# Altium schematic sheet subckt_Attenuator_HMC539ALP3.SchDoc: Attenuator HMC539ALP3
size A3; DocumentNumber: 11; Revision: 0; SheetNumber: 11; SheetTotal: 19
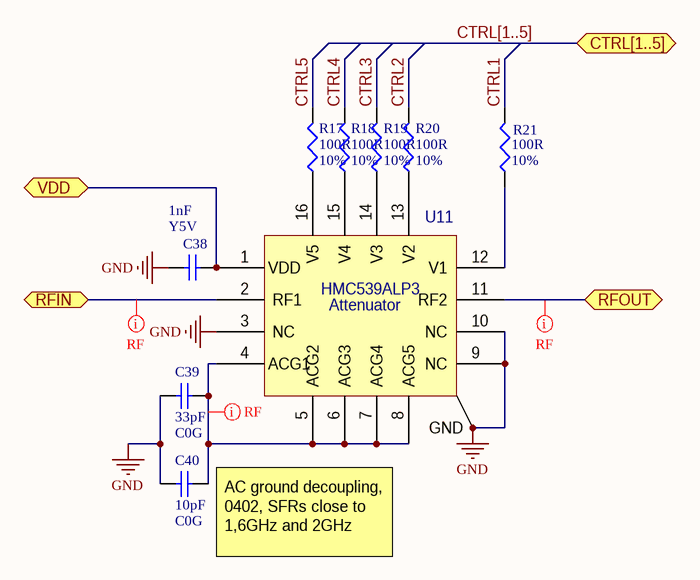
[diagram p0: subckt_Attenuator_HMC539ALP3.SchDoc]

## Parts
C38  value 1nF  Dielectric: Y5V  [CAP0603]  (hidden comment: Capacitor)
C39  value 33pF  Dielectric: C0G  [Model Name]  (hidden comment: Capacitor)
C40  value 10pF  Dielectric: C0G  [Model Name]  (hidden comment: Capacitor)
R17  value 100R  Type: 10%  [RES0603]  (hidden comment: Resistor)
R18  value 100R  Type: 10%  [RES0603]  (hidden comment: Resistor)
R19  value 100R  Type: 10%  [RES0603]  (hidden comment: Resistor)
R20  value 100R  Type: 10%  [RES0603]  (hidden comment: Resistor)
R21  value 100R  Type: 10%  [RES0603]  (hidden comment: Resistor)
U11  HMC539ALP3

## Ports
CTRL[1..5], RFIN, RFOUT, VDD

## Nets
GND: C38.2 C39.1 C40.1 U11.3(NC) U11.9(NC) U11.10(NC) U11.17(GND)
CTRL1: R21.2
CTRL2: R20.2
CTRL3: R19.2
CTRL4: R18.2
CTRL5: R17.2
RFIN: U11.2(RF1) ; port RFIN
RFOUT: U11.11(RF2) ; port RFOUT
VDD: C38.1 U11.1(VDD) ; port VDD
NetC39_2: C39.2 C40.2 U11.4(ACG1) U11.5(ACG2) U11.6(ACG3) U11.7(ACG4) U11.8(ACG5)
NetR17_1: R17.1 U11.16(V5)
NetR18_1: R18.1 U11.15(V4)
NetR19_1: R19.1 U11.14(V3)
NetR20_1: R20.1 U11.13(V2)
NetR21_1: R21.1 U11.12(V1)

## Buses and harness runs
bus CTRL[1..5] = port CTRL[1..5]

## Layout directives
net class RF: NetC39_2, RFIN, RFOUT

## Notes on the sheet
- AC ground decoupling, 0402, SFRs close to 1,6GHz and 2GHz
- (in symbol AD_HMC539ALP3) Attenuator

## Library data of the parts
U11 = AD_HMC539ALP3: Attenuator 7.75dB, DC-4GHz, 0.25dB LSB